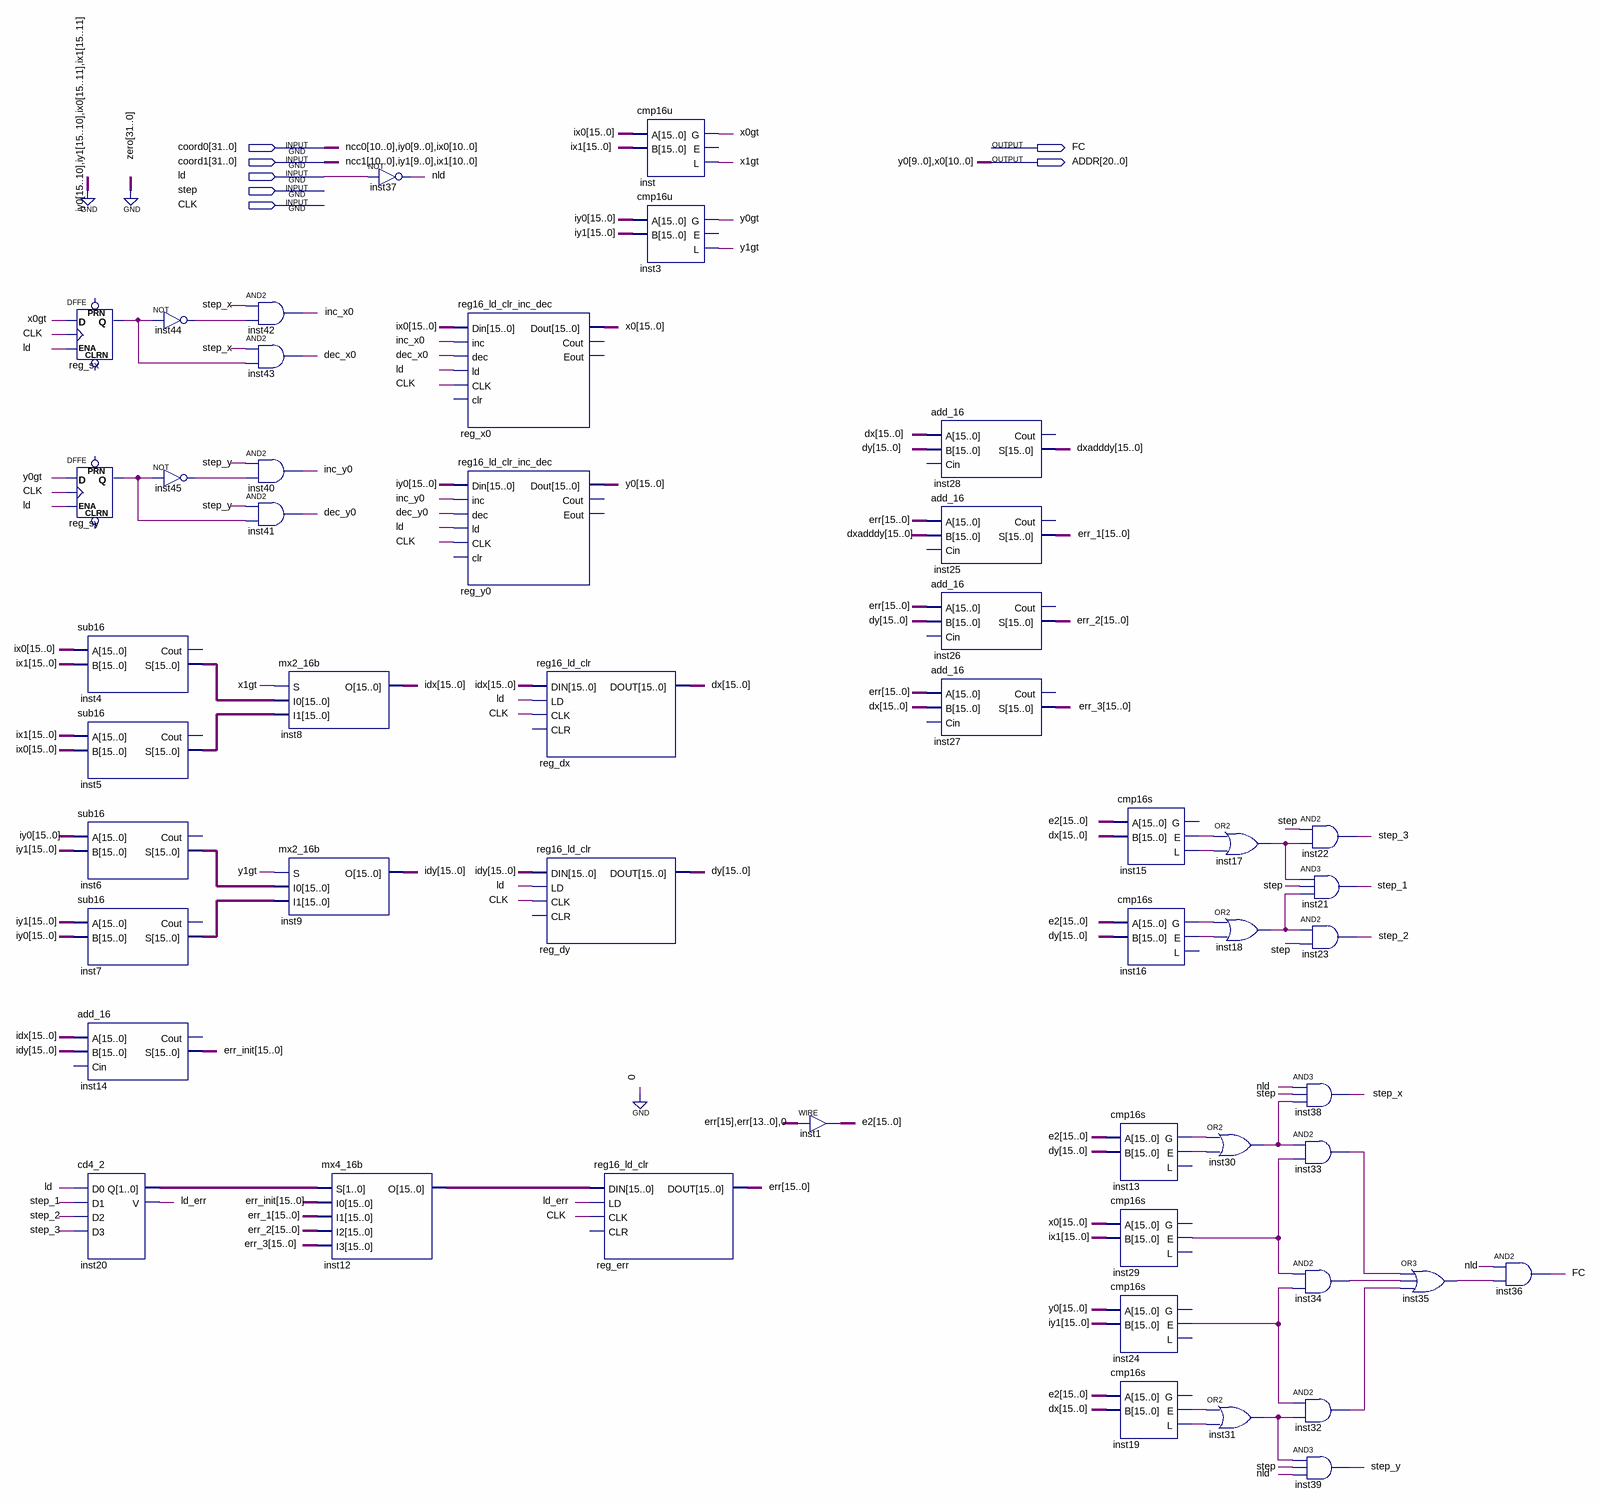
[diagram p0: schematic sheet]
// Quartus schematic gca_dln.bdf as structural Verilog: 50 symbols, 7 pins
module gca_dln (
  input  [31:0] coord0,
  input  [31:0] coord1,
  input  ld,
  input  step,
  input  CLK,
  output FC,
  output [20:0] ADDR
);

  wire dec_x0, dec_y0, inc_x0, inc_y0, inst13_e, inst13_g, inst15_e, inst15_l, inst16_e, inst16_g,
       inst17_out, inst18_out, inst19_e, inst19_l, inst24_e, inst29_e, inst30_out, inst31_out, inst32_out,
       inst33_out, inst34_out, inst35_out, inst44_out, inst45_out, ld_err, nld, reg_sx_q, reg_sy_q, step_1,
       step_2, step_3, step_x, step_y, x0gt, x1gt, y0gt, y1gt;
  wire [1:0] inst20_q;
  wire [15:0] dx, dxadddy, dy, e2, err, err_1, err_2, err_3, err_init, idx, idy, inst4_s, inst5_s, inst6_s,
       inst7_s, inst12_o;
  wire [15:10] y0;
  wire [15:11] x0;

  DFFE reg_sx (.D(x0gt), .CLK(CLK), .ENA(ld), .Q(reg_sx_q));  // open: PRN, CLRN
  DFFE reg_sy (.D(y0gt), .CLK(CLK), .ENA(ld), .Q(reg_sy_q));  // open: PRN, CLRN
  sub16 inst4 (.A({{5{1'b0}}, coord0[10:0]}), .B({{5{1'b0}}, coord1[10:0]}), .S(inst4_s));  // open: Cout
  sub16 inst5 (.A({{5{1'b0}}, coord1[10:0]}), .B({{5{1'b0}}, coord0[10:0]}), .S(inst5_s));  // open: Cout
  sub16 inst6 (.A({{6{1'b0}}, coord0[20:11]}), .B({{6{1'b0}}, coord1[20:11]}), .S(inst6_s));  // open: Cout
  sub16 inst7 (.A({{6{1'b0}}, coord1[20:11]}), .B({{6{1'b0}}, coord0[20:11]}), .S(inst7_s));  // open: Cout
  add_16 inst14 (.A(idx), .B(idy), .S(err_init));  // open: Cin, Cout
  cd4_2 inst20 (.D0(ld), .D1(step_1), .D2(step_2), .D3(step_3), .Q(inst20_q), .V(ld_err));
  not inst44 (inst44_out, reg_sx_q);
  not inst45 (inst45_out, reg_sy_q);
  and inst42 (inc_x0, step_x, inst44_out);
  and inst43 (dec_x0, step_x, reg_sx_q);
  and inst40 (inc_y0, step_y, inst45_out);
  and inst41 (dec_y0, step_y, reg_sy_q);
  mx2_16b inst8 (.S(x1gt), .I0(inst4_s), .I1(inst5_s), .O(idx));
  mx2_16b inst9 (.S(y1gt), .I0(inst6_s), .I1(inst7_s), .O(idy));
  mx4_16b inst12 (.S(inst20_q), .I0(err_init), .I1(err_1), .I2(err_2), .I3(err_3), .O(inst12_o));
  not inst37 (nld, ld);
  reg16_ld_clr_inc_dec reg_x0 (
    .Din({{5{1'b0}}, coord0[10:0]}), .inc(inc_x0), .dec(dec_x0), .ld(ld), .CLK(CLK), .Dout({x0, ADDR[10:0]}));  // open: clr, Cout, Eout
  reg16_ld_clr_inc_dec reg_y0 (
    .Din({{6{1'b0}}, coord0[20:11]}), .inc(inc_y0), .dec(dec_y0), .ld(ld), .CLK(CLK), .Dout({y0, ADDR[20:11]}));  // open: clr, Cout, Eout
  reg16_ld_clr reg_dx (.DIN(idx), .LD(ld), .CLK(CLK), .DOUT(dx));  // open: CLR
  reg16_ld_clr reg_dy (.DIN(idy), .LD(ld), .CLK(CLK), .DOUT(dy));  // open: CLR
  reg16_ld_clr reg_err (.DIN(inst12_o), .LD(ld_err), .CLK(CLK), .DOUT(err));  // open: CLR
  cmp16u inst (.A({{5{1'b0}}, coord0[10:0]}), .B({{5{1'b0}}, coord1[10:0]}), .G(x0gt), .L(x1gt));  // open: E
  cmp16u inst3 (.A({{6{1'b0}}, coord0[20:11]}), .B({{6{1'b0}}, coord1[20:11]}), .G(y0gt), .L(y1gt));  // open: E
  assign e2 = {err[15], err[13:0], 1'b0};  // WIRE inst1
  add_16 inst28 (.A(dx), .B(dy), .S(dxadddy));  // open: Cin, Cout
  add_16 inst25 (.A(err), .B(dxadddy), .S(err_1));  // open: Cin, Cout
  add_16 inst26 (.A(err), .B(dy), .S(err_2));  // open: Cin, Cout
  add_16 inst27 (.A(err), .B(dx), .S(err_3));  // open: Cin, Cout
  cmp16s inst15 (.A(e2), .B(dx), .E(inst15_e), .L(inst15_l));  // open: G
  cmp16s inst16 (.A(e2), .B(dy), .G(inst16_g), .E(inst16_e));  // open: L
  cmp16s inst13 (.A(e2), .B(dy), .G(inst13_g), .E(inst13_e));  // open: L
  cmp16s inst29 (.A({x0, ADDR[10:0]}), .B({{5{1'b0}}, coord1[10:0]}), .E(inst29_e));  // open: G, L
  cmp16s inst24 (.A({y0, ADDR[20:11]}), .B({{6{1'b0}}, coord1[20:11]}), .E(inst24_e));  // open: G, L
  cmp16s inst19 (.A(e2), .B(dx), .E(inst19_e), .L(inst19_l));  // open: G
  or inst17 (inst17_out, inst15_e, inst15_l);
  or inst18 (inst18_out, inst16_g, inst16_e);
  or inst30 (inst30_out, inst13_g, inst13_e);
  or inst31 (inst31_out, inst19_e, inst19_l);
  and inst22 (step_3, step, inst17_out);
  and inst21 (step_1, inst17_out, step, inst18_out);
  and inst23 (step_2, inst18_out, step);
  and inst38 (step_x, nld, step, inst30_out);
  and inst33 (inst33_out, inst30_out, inst29_e);
  and inst34 (inst34_out, inst29_e, inst24_e);
  and inst32 (inst32_out, inst24_e, inst31_out);
  and inst39 (step_y, inst31_out, step, nld);
  or inst35 (inst35_out, inst33_out, inst34_out, inst32_out);
  and inst36 (FC, nld, inst35_out);

  // Other names for the same wires on the sheet: ix0[10:0] = coord0[10:0]; ix1[10:0] = coord1[10:0];
  //   iy0[9:0] = coord0[20:11]; iy1[9:0] = coord1[20:11]; ncc0[10:0] = coord0[31:21]; ncc1[10:0] = coord1[31:21];
  //   x0[10:0] = ADDR[10:0]; y0[9:0] = ADDR[20:11]
endmodule
